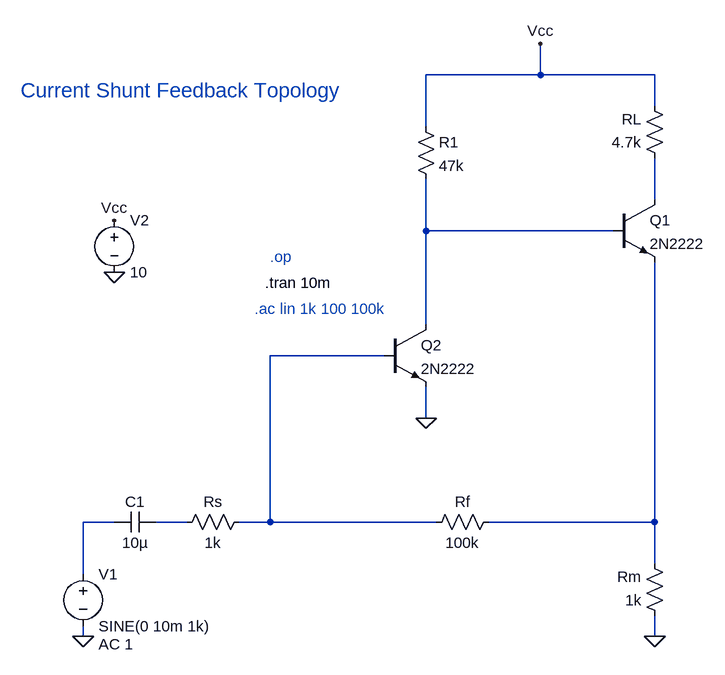
[diagram p0: schematic Current_Shunt_Feedback.asc]
Current_Shunt_Feedback.asc, the LTspice schematic file:
Version 4.1
SHEET 1 880 716
WIRE 368 -176 368 -224
WIRE 368 -176 192 -176
WIRE 544 -176 368 -176
WIRE 544 -128 544 -176
WIRE 192 -96 192 -176
WIRE 544 16 544 -48
WIRE 192 64 192 -16
WIRE 480 64 192 64
WIRE 192 208 192 64
WIRE 128 256 -48 256
WIRE 192 352 192 304
WIRE -288 512 -336 512
WIRE -176 512 -224 512
WIRE -48 512 -48 256
WIRE -48 512 -96 512
WIRE 208 512 -48 512
WIRE 544 512 544 112
WIRE 544 512 288 512
WIRE 544 576 544 512
WIRE -336 592 -336 512
WIRE -336 688 -336 672
WIRE 544 688 544 656
FLAG -288 128 0
FLAG -288 48 Vcc
FLAG 192 352 0
FLAG 544 688 0
FLAG 368 -224 Vcc
FLAG -336 688 0
SYMBOL npn 480 16 R0
SYMATTR InstName Q1
SYMATTR Value 2N2222
SYMBOL npn 128 208 R0
SYMATTR InstName Q2
SYMATTR Value 2N2222
SYMBOL voltage -336 576 R0
WINDOW 123 24 124 Left 2
WINDOW 39 0 0 Left 0
SYMATTR InstName V1
SYMATTR Value SINE(0 10m 1k)
SYMATTR Value2 AC 1
SYMBOL voltage -288 32 R0
WINDOW 123 0 0 Left 0
WINDOW 39 0 0 Left 0
SYMATTR InstName V2
SYMATTR Value 10
SYMBOL res -80 496 R90
WINDOW 0 0 56 VBottom 2
WINDOW 3 32 56 VTop 2
SYMATTR InstName Rs
SYMATTR Value 1k
SYMBOL res 304 496 R90
WINDOW 0 0 56 VBottom 2
WINDOW 3 32 56 VTop 2
SYMATTR InstName Rf
SYMATTR Value 100k
SYMBOL res 560 -32 R180
WINDOW 0 36 76 Left 2
WINDOW 3 36 40 Left 2
SYMATTR InstName RL
SYMATTR Value 4.7k
SYMBOL res 560 672 R180
WINDOW 0 36 76 Left 2
WINDOW 3 36 40 Left 2
SYMATTR InstName Rm
SYMATTR Value 1k
SYMBOL cap -224 496 R90
WINDOW 0 0 32 VBottom 2
WINDOW 3 32 32 VTop 2
SYMATTR InstName C1
SYMATTR Value 10µ
SYMBOL res 176 -112 R0
SYMATTR InstName R1
SYMATTR Value 47k
TEXT -432 -152 Left 3 ;Current Shunt Feedback Topology
TEXT -56 144 Left 2 !.tran 10m
TEXT -48 104 Left 2 ;.op
TEXT -72 184 Left 2 ;.ac lin 1k 100 100k

The netlist it stands for:
* Current_Shunt_Feedback.asc
Q1 N001 N002 N006 0 2N2222
Q2 N002 N003 0 0 2N2222
V1 N004 0 SINE(0 10m 1k) AC 1
V2 Vcc 0 10
Rs N003 N005 1k
Rf N006 N003 100k
RL N001 Vcc 4.7k
Rm 0 N006 1k
C1 N005 N004 10µ
R1 Vcc N002 47k
.model NPN NPN
.model PNP PNP
.lib standard.bjt
* Current Shunt Feedback Topology
.tran 10m
* .op
* .ac lin 1k 100 100k
.backanno
.end